# EAGLE design Nucleo_DCO_Output (EAGLE 9.0.1)
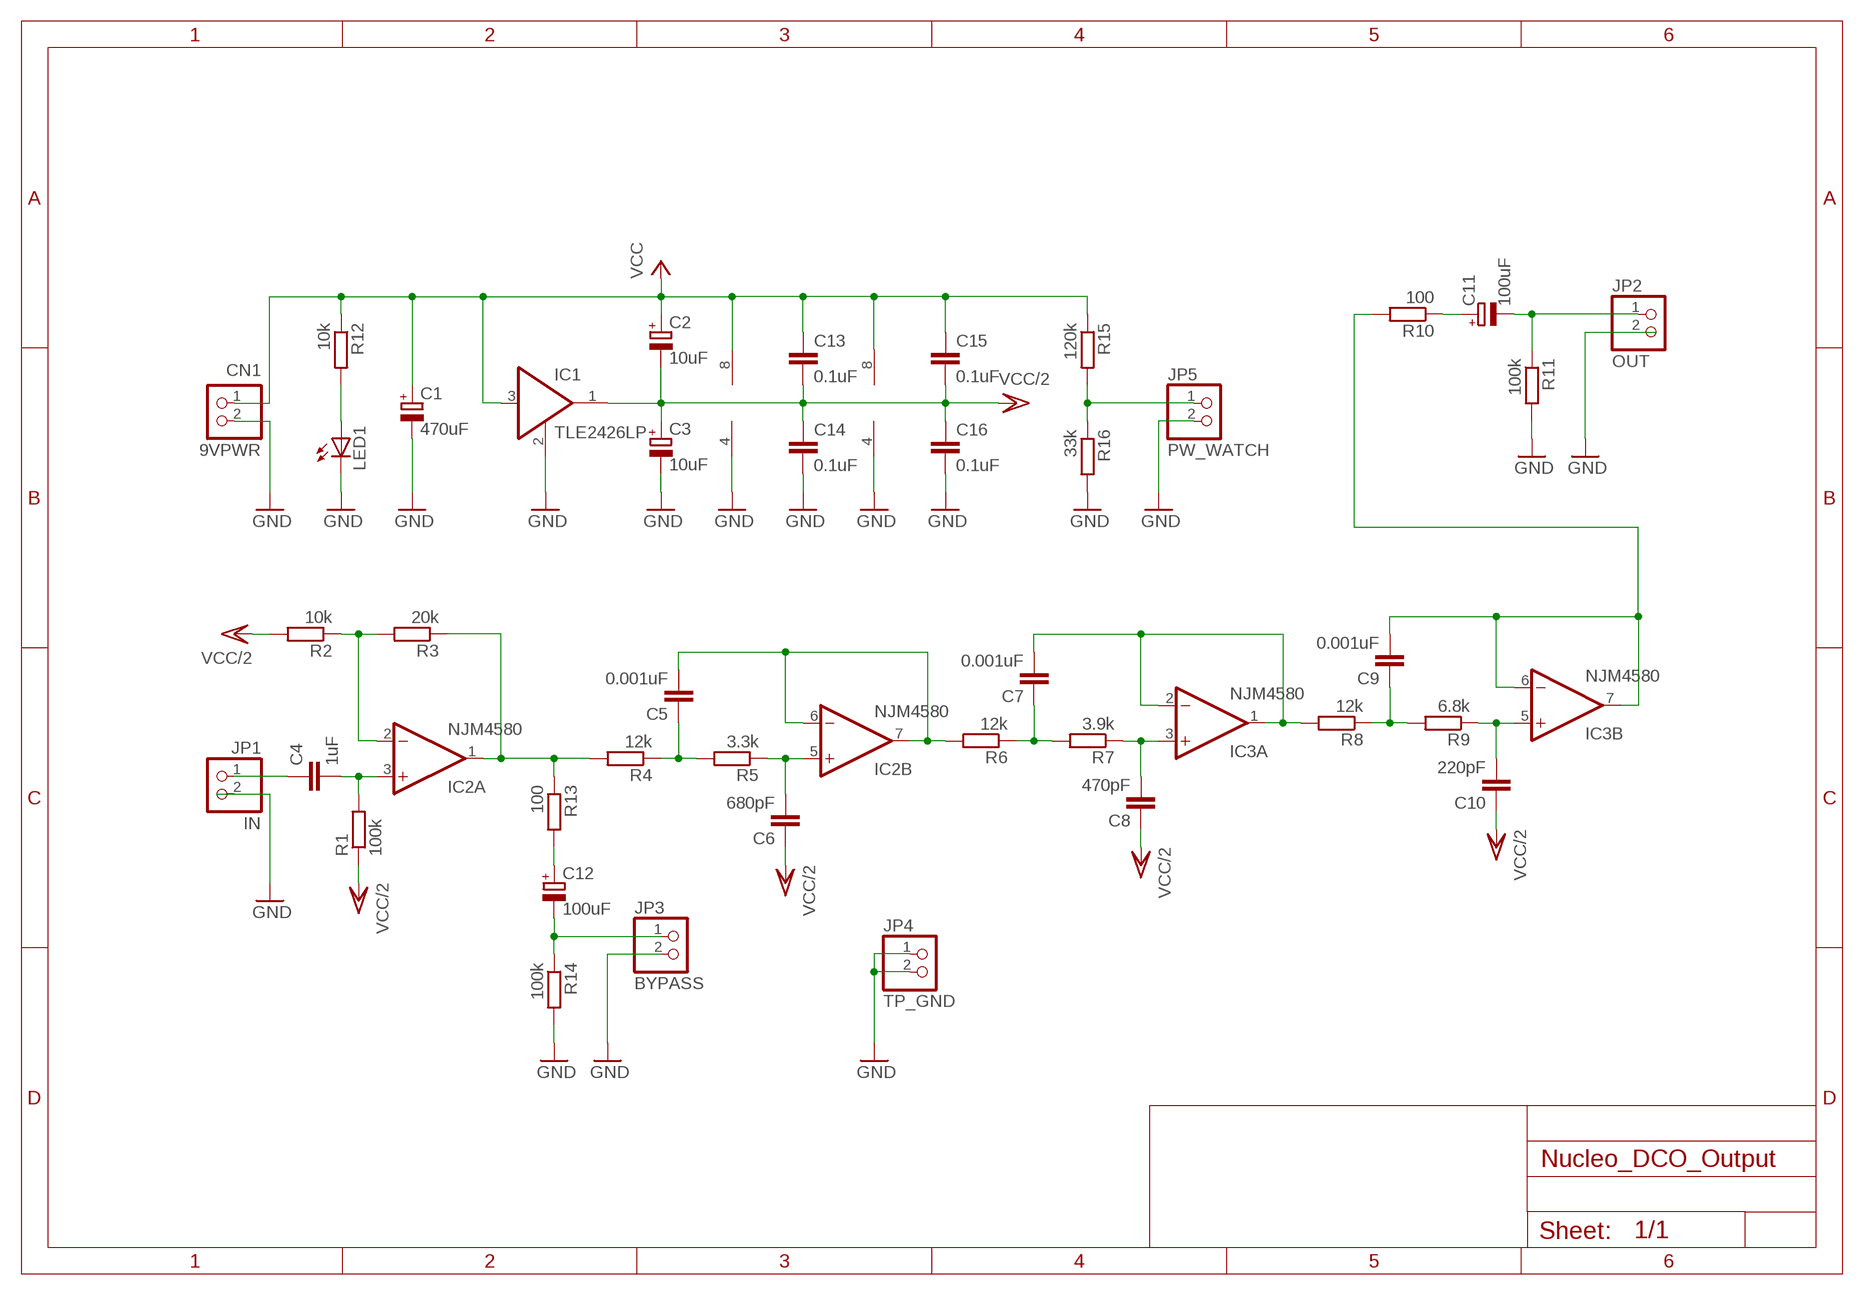
[diagram p0: schematic, sheet 1]

## Parts
C1  470uF  CPOL-EUSANYO_F13  [SANYO-OSCON_F13]
C2  10uF  CPOL-EUE2.5-6  [E2,5-6]
C3  10uF  CPOL-EUE2.5-6  [E2,5-6]
C4  1uF  C-EU050-035X075  [C050-035X075]
C5  0.001uF  C-EU050-035X075  [C050-035X075]
C6  680pF  C-EU050-035X075  [C050-035X075]
C7  0.001uF  C-EU050-035X075  [C050-035X075]
C8  470pF  C-EU050-035X075  [C050-035X075]
C9  0.001uF  C-EU050-035X075  [C050-035X075]
C10  220pF  C-EU050-035X075  [C050-035X075]
C11  100uF  CPOL-EUE5-8.5  [E5-8,5]
C12  100uF  CPOL-EUE5-8.5  [E5-8,5]
C13  0.1uF  C-EU025-024X044  [C025-024X044]
C14  0.1uF  C-EU050-024X044  [C050-024X044]
C15  0.1uF  C-EU025-024X044  [C025-024X044]
C16  0.1uF  C-EU025-024X044  [C025-024X044]
CN1  9VPWR  B2B-XH-A  [B2B-XH-A]
IC1  TLE2426LP  [TO226AA]
IC2  NJM4580  LM4558N  [DIL08]
IC3  NJM4580  LM4558N  [DIL08]
JP1  IN  PINHD-1X2  [1X02]
JP2  OUT  PINHD-1X2  [1X02]
JP3  BYPASS  PINHD-1X2  [1X02]
JP4  TP_GND  PINHD-1X2  [1X02]
JP5  PW_WATCH  PINHD-1X2  [1X02]
LED1  LED3MM  [LED3MM]
R1  100k  R-EU_0207/7  [0207/7]
R2  10k  R-EU_0207/7  [0207/7]
R3  20k  R-EU_0207/7  [0207/7]
R4  12k  R-EU_0207/7  [0207/7]
R5  3.3k  R-EU_0207/7  [0207/7]
R6  12k  R-EU_0207/7  [0207/7]
R7  3.9k  R-EU_0207/7  [0207/7]
R8  12k  R-EU_0207/7  [0207/7]
R9  6.8k  R-EU_0207/7  [0207/7]
R10  100  R-EU_0207/7  [0207/7]
R11  100k  R-EU_0207/7  [0207/7]
R12  10k  R-EU_0207/7  [0207/7]
R13  100  R-EU_0207/7  [0207/7]
R14  100k  R-EU_0207/7  [0207/7]
R15  120k  R-EU_0207/7  [0207/7]
R16  33k  R-EU_0207/7  [0207/7]

## Nets
GND: C1.- C3.- C14.2 C16.2 CN1.2 IC1.2 IC2.4(P:V-) IC3.4(P:V-) JP1.2 JP2.2 JP3.2 JP4.1 JP4.2 JP5.2 LED1.K(C) R11.2 R14.2 R16.2
N$1: IC2.1(A:OUT) R3.1 R4.2 R13.1
N$2: IC2.2(A:-IN) R2.1 R3.2
N$3: C6.2 IC2.5(B:+IN) R5.1
N$4: C4.1 JP1.1
N$5: C4.2 IC2.3(A:+IN) R1.2
N$6: C5.1 R4.1 R5.2
N$7: C11.+ R10.1
N$8: C11.- JP2.1 R11.1
N$9: C5.2 IC2.6(B:-IN) IC2.7(B:OUT) R6.2
N$10: C8.2 IC3.3(A:+IN) R7.1
N$11: C7.1 R6.1 R7.2
N$12: LED1.A R12.2
N$13: C7.2 IC3.1(A:OUT) IC3.2(A:-IN) R8.2
N$14: C10.2 IC3.5(B:+IN) R9.1
N$15: C9.1 R8.1 R9.2
N$16: C9.2 IC3.6(B:-IN) IC3.7(B:OUT) R10.2
N$18: C12.+ R13.2
N$19: C12.- JP3.1 R14.1
N$20: JP5.1 R15.2 R16.1
VCC: C1.+ C2.+ C13.1 C15.1 CN1.1 IC1.3(I) IC2.8(P:V+) IC3.8(P:V+) R12.1 R15.1
VCC/2: C2.- C3.+ C6.1 C8.1 C10.1 C13.2 C14.1 C15.2 C16.1 IC1.1(O) R1.1 R2.2

## Library data of the parts
C1-C3 C11 C12 = rcl:CPOL-EU: POLARIZED CAPACITOR, European symbol; SPICEPREFIX: C
C4-C10 C13-C16 = rcl:C-EU: CAPACITOR, European symbol; SPICEPREFIX: C
CN1 = jst-xh:B2B-XH-A: Wire-to-Board 2.5mm pitch top mount connector Source: http://www.jst-mfg.com/product/pdf/jpn/XH.pdf http://www.jst-mfg.com/product/detail.php?series=277
IC1 = mylib2:TLE2426LP: TLE2426 Rail Spliter TO-92
IC2 IC3 = linear:*4558: OP AMP
JP1-JP5 = pinhead:PINHD-1X2: PIN HEADER
LED1 = led:LED: LED OSRAM: - CHIPLED LG R971, LG N971, LY N971, LG Q971, LY Q971, LO R971, LY R971 LH N974, LH R974 LS Q976, LO Q976, LY Q976 LO Q996 - Hyper CHIPLED LW Q18S LB Q993, LB Q99A, LB R99A - SideLED LS A670, LO A670, LY A670, LG A670, LP A670 LB A673, LV A673, LT A673, LW A673 LH A674 LY A675 LS A676, LA A676, LO A676, LY A676, LW A676 LS A679, LY A679, LG A679 - Hyper Micro SIDELED® LS Y876, LA Y876, LO Y876, LY Y876 LT Y87S - SmartLED LW L88C, LW L88S LB L89C, LB L89S, LG L890 LS L89K, LO L89K, LY L89K LS L896, LA L896, LO L896, LY L896 - TOPLED LS T670, LO T670, LY T670, LG T670, LP T670 LSG T670, LSP T670, LSY T670, LOP T670, LYG T670 LG T671, LOG T671, LSG T671 LB T673, LV T673, LT T673, LW T673 LH T674 LS T676, LA T676, LO T676, LY T676, LB T676, LH T676, LSB T676, LW T676 LB T67C, LV T67C, LT T67C, LS T67K, LO T67K, LY T67K, LW E67C LS E67B, LA E67B, LO E67B, LY E67B, LB E67C, LV E67C, LT E67C LW T67C LS T679, LY T679, LG T679 LS T770, LO T770, LY T770, LG T770, LP T770 LB T773, LV T773, LT T773, LW T773 LH T774 LS E675, LA E675, LY E675, LS T675 LS T776, LA T776, LO T776, LY T776, LB T776 LHGB T686 LT T68C, LB T68C - Hyper Mini TOPLED® LB M676 - Mini TOPLED Santana® LG M470 LS M47K, LO M47K, LY M47K Source: http://www.osram.convergy.de LUXEON: - LUMILED® LXK2-PW12-R00, LXK2-PW12-S00, LXK2-PW14-U00, LXK2-PW14-V00 LXK2-PM12-R00, LXK2-PM12-S00, LXK2-PM14-U00 LXK2-PE12-Q00, LXK2-PE12-R00, LXK2-PE12-S00, LXK2-PE14-T00, LXK2-PE14-U00 LXK2-PB12-K00, LXK2-PB12-L00, LXK2-PB12-M00, LXK2-PB14-N00, LXK2-PB14-P00, LXK2-PB14-Q00 LXK2-PR12-L00, LXK2-PR12-M00, LXK2-PR14-Q00, LXK2-PR14-R00 LXK2-PD12-Q00, LXK2-PD12-R00, LXK2-PD12-S00 LXK2-PH12-R00, LXK2-PH12-S00 LXK2-PL12-P00, LXK2-PL12-Q00, LXK2-PL12-R00 Source: www.luxeon.com KINGBRIGHT: KA-3528ASYC Source: www.kingbright.com
R1-R16 = rcl:R-EU_: RESISTOR, European symbol; SPICEPREFIX: R

## Board
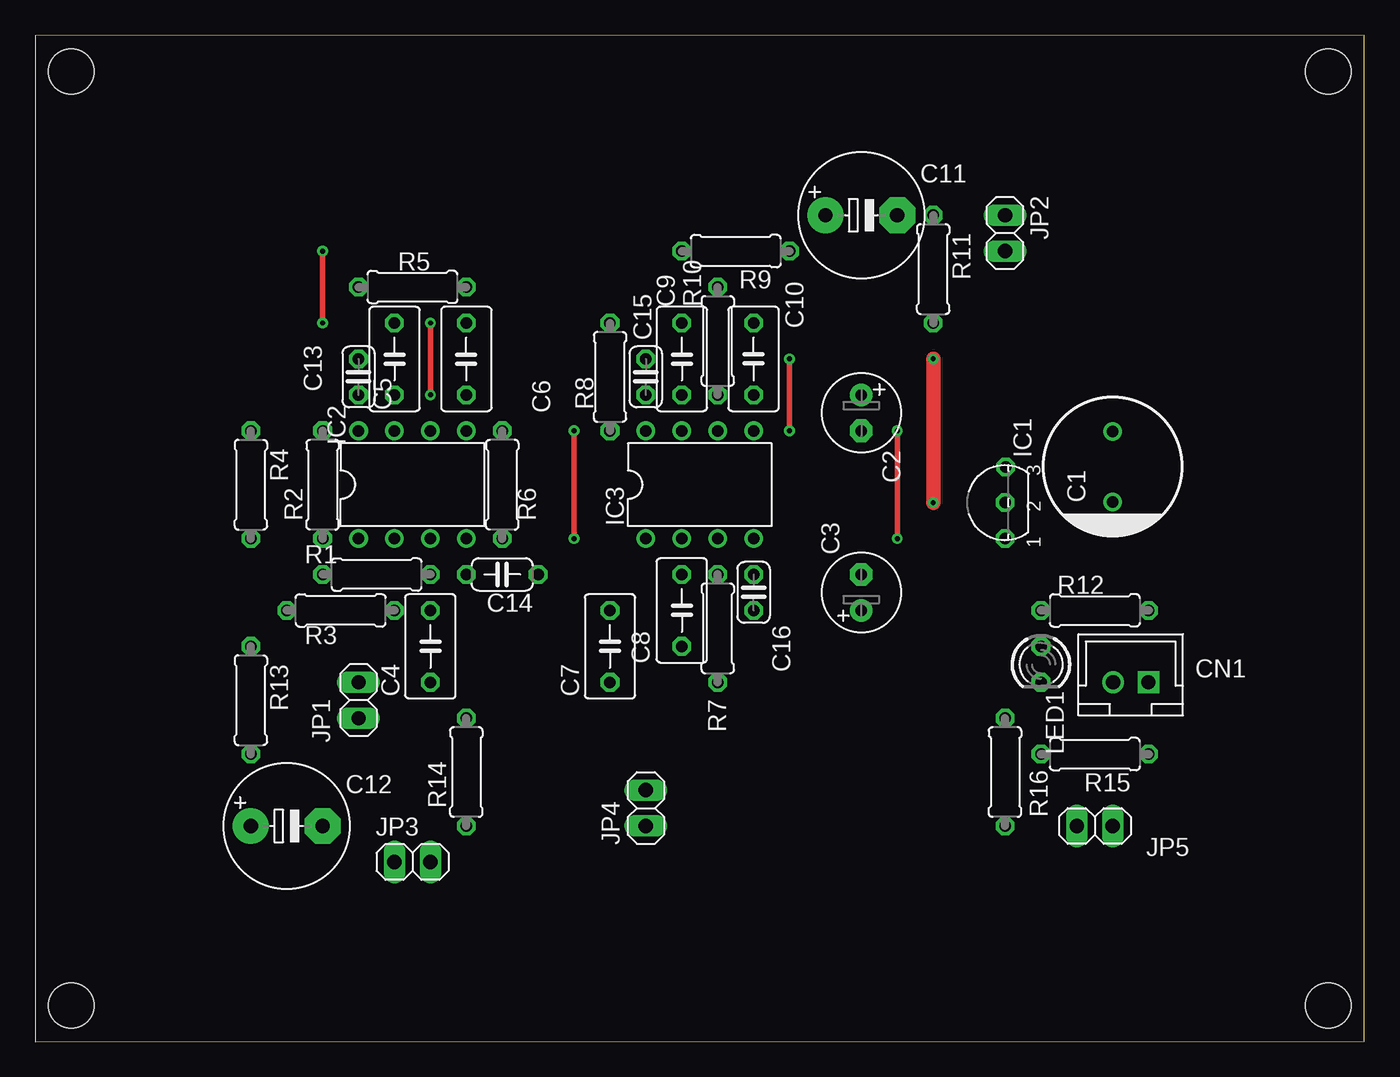
[diagram p1: board, top side]
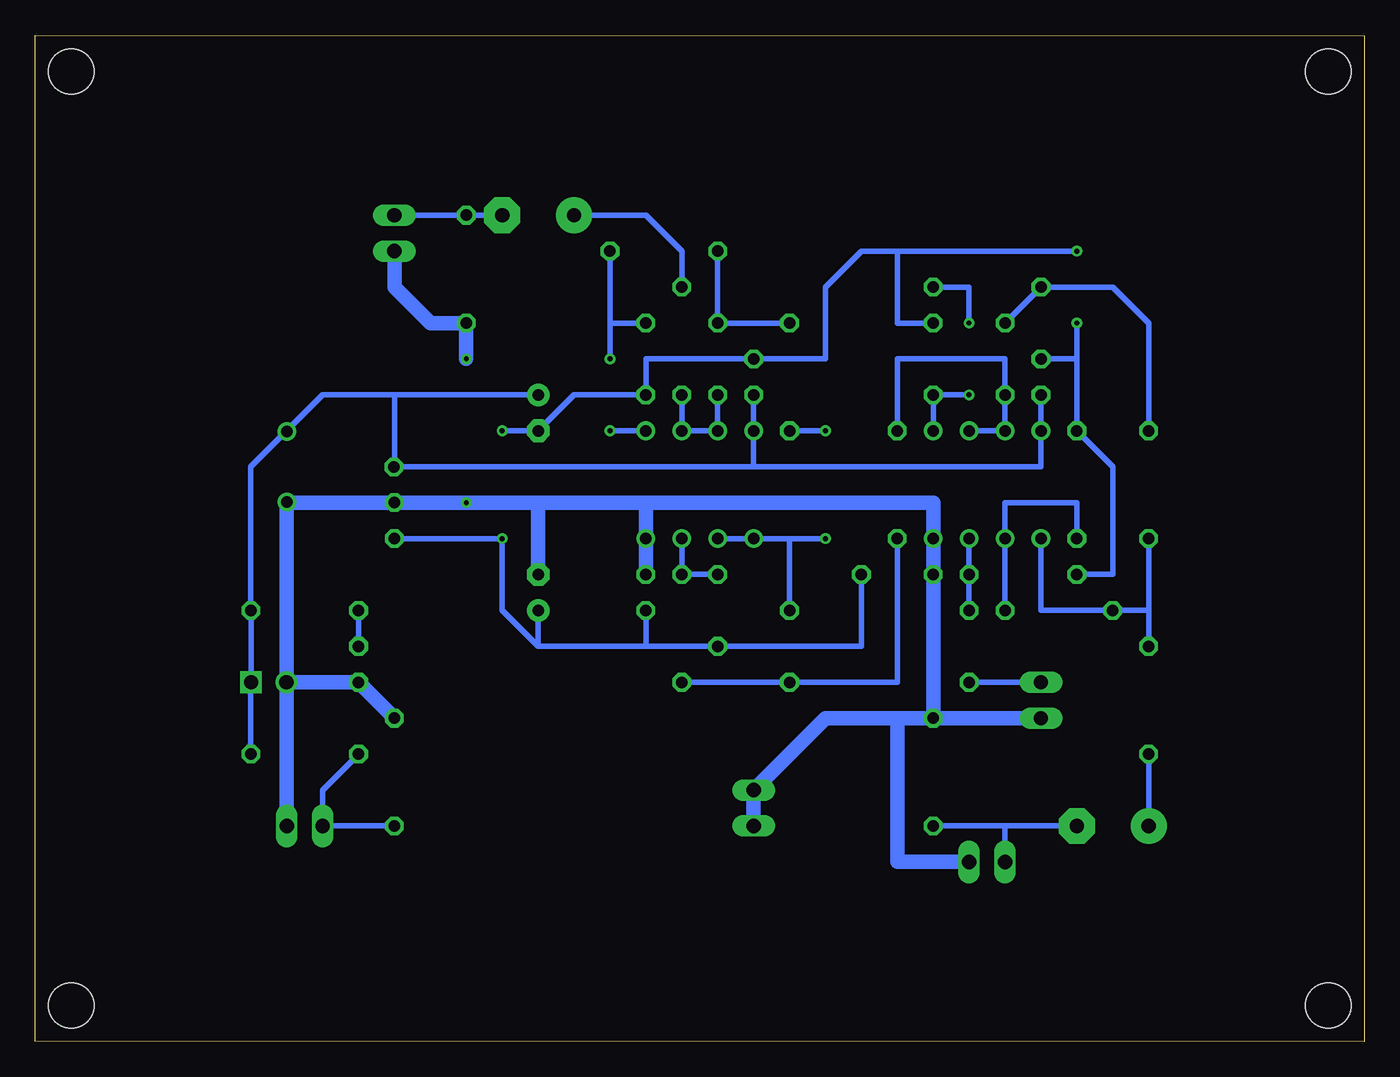
[diagram p2: board, bottom side, seen from below]

Size 93.98 x 71.14 mm. Coordinates in mm from the lower left corner, seen from the top.
Outline: 0,0 93.98,0.03 93.98,71.14 0,71.11 0,0
Copper layers (1*16): Top 0.035mm / dielectric 1.5mm / Bottom 0.035mm
Design rules "default": minimum track width 6mil, minimum drill 0.35mm, track to track 6mil, track to pad 6mil, pad to pad 6mil, via to via 6mil, smd to smd 6mil, copper to edge 40mil, drill to drill 6mil, minimum pad ring 10mil, minimum via ring 8mil, stop-mask expansion 4mil, vias tented up to drill 0mil, thermal gap 10mil
Holes 3.2 mm at 2.54,68.58 2.54,2.54 91.44,2.54 91.44,68.58

### Footprints (pad centres in the part's own frame; a part is rotated, then mirrored left to right if it is on the bottom)
SANYO-OSCON_F13 = drill 0.8 pad 1.27: + 2.5,0; - -2.5,0
E2,5-6 = drill 0.813 pad 1.6: + -1.27,0 | drill 0.813 pad 1.6 octagon: - 1.27,0
C050-035X075 = drill 0.813 octagon: 1 -2.54,0; 2 2.54,0
E5-8,5 = drill 1.016 pad 2.54: + -2.54,0 | drill 1.016 pad 2.54 octagon: - 2.54,0
C025-024X044 = drill 0.813 octagon: 1 -1.27,0; 2 1.27,0
C050-024X044 = drill 0.813 octagon: 1 -2.54,0; 2 2.54,0
B2B-XH-A = drill 1.016 square: 1 -1.25,0 | drill 1.016: 2 1.25,0
TO226AA = drill 0.813 octagon: 1 -2.544,0; 2 0.001,0; 3 2.524,-0.04
DIL08 = drill 0.813 pad 1.27: 1 -3.81,-3.81; 2 -1.27,-3.81; 3 1.27,-3.81; 4 3.81,-3.81; 5 3.81,3.81; 6 1.27,3.81; 7 -1.27,3.81; 8 -3.81,3.81
1X02 = drill 1.016 long: 1 -1.27,0; 2 1.27,0
LED3MM = drill 0.813 octagon: A -1.27,0; K 1.27,0
0207/7 = drill 0.813 octagon: 1 -3.81,0; 2 3.81,0

### Placement (x,y rotation side)
C1  76.2,40.64 90 top
C2  58.42,44.45 270 top
C3  58.42,31.75 90 top
C4  27.94,27.94 90 top
C5  25.4,48.26 270 top
C6  30.48,48.26 270 top
C7  40.64,27.94 90 top
C8  45.72,30.48 90 top
C9  45.72,48.26 270 top
C10  50.8,48.26 90 top
C11  58.42,58.42 0 top
C12  17.78,15.24 0 top
C13  22.86,46.99 90 top
C14  33.02,33.02 180 top
C15  43.18,46.99 90 top
C16  50.8,31.75 90 top
CN1  77.47,25.4 180 top
IC1  68.58,38.1 90 top
IC2  26.67,39.37 0 top
IC3  46.99,39.37 0 top
JP1  22.86,24.13 270 top
JP2  68.58,57.15 270 top
JP3  26.67,12.7 0 top
JP4  43.18,16.51 90 top
JP5  74.93,15.24 0 top
LED1  71.12,26.67 270 top
R1  24.13,33.02 0 top
R2  20.32,39.37 90 top
R3  21.59,30.48 0 top
R4  15.24,39.37 270 top
R5  26.67,53.34 180 top
R6  33.02,39.37 90 top
R7  48.26,29.21 270 top
R8  40.64,46.99 270 top
R9  49.53,55.88 180 top
R10  48.26,49.53 270 top
R11  63.5,54.61 270 top
R12  74.93,30.48 180 top
R13  15.24,24.13 270 top
R14  30.48,19.05 90 top
R15  74.93,20.32 180 top
R16  68.58,19.05 90 top

### Tracks (layer width: path | path; a pad name or v marks a point on that pad's centre or on a via)
GND  (via drill 0.35)
  Top 1.016: v63.5,48.26 v63.5,38.1
  Bottom 0.406: 66.04,38.1
  Bottom 1.016: 50.8,38.1 30.48,38.1 IC2.4 C14.2 R14.2 | 50.8,38.1 IC3.4 C16.2 | 66.04,38.1 v63.5,38.1 58.42,38.1 | 58.42,38.1 50.8,38.1 | C3.- 58.42,38.1 | IC1.2 66.04,38.1 | C1.- 76.16,38.1 | 76.16,38.1 IC1.2 | IC1.2 | 76.2,25.42 CN1.2 LED1.K R16.2 | 76.2,25.42 76.2,38.1 76.16,38.1 | R14.2 33.02,22.86 | 33.02,22.86 38.1,22.86 JP4.2 JP4.1 | JP1.2 R14.2 | JP3.2 33.02,12.7 33.02,22.86 | v63.5,48.26 R11.2 66.04,50.8 68.58,53.34 JP2.2 | JP5.2 76.2,25.42
N$1
  Bottom 0.406: IC2.1 22.86,30.48 R3.1 15.24,30.48 | R4.2 15.24,30.48 | 15.24,30.48 R13.1
N$2
  Bottom 0.406: R3.2 IC2.2 25.4,38.1 20.32,38.1 R2.1
N$3  (via drill 0.35)
  Top 0.406: v27.94,45.72 v27.94,50.8
  Bottom 0.406: IC2.5 C6.2 v27.94,45.72 | R5.1 27.94,53.34 v27.94,50.8
N$4
  Bottom 0.406: JP1.1 C4.1
N$5
  Bottom 0.406: IC2.3 R1.2 C4.2
N$6
  Bottom 0.406: C5.1 R5.2 17.78,53.34 15.24,50.8 R4.1
N$7
  Bottom 0.406: R10.1 48.26,55.88 50.8,58.42 C11.+
N$8
  Bottom 0.406: C11.- R11.1 JP2.1
N$9
  Bottom 0.406: IC2.6 IC2.7 C5.2 25.4,48.26 33.02,48.26 R6.2
N$10
  Bottom 0.406: IC3.3 R7.1 C8.2
N$11
  Bottom 0.406: R6.1 33.02,25.4 C7.1 R7.2
N$12
  Bottom 0.406: R12.2 LED1.A
N$13  (via drill 0.35)
  Top 0.406: v38.1,35.56 v38.1,43.18
  Bottom 0.406: IC3.2 IC3.1 40.64,35.56 | 40.64,35.56 v38.1,35.56 | v38.1,43.18 R8.2 | C7.2 40.64,35.56
N$14  (via drill 0.35)
  Top 0.406: v53.34,43.18 v53.34,48.26
  Bottom 0.406: IC3.5 v53.34,43.18 | v53.34,48.26 53.34,50.8 | 53.34,50.8 R9.1 | C10.2 53.34,50.8
N$15
  Bottom 0.406: R8.1 C9.1 R9.2
N$16
  Bottom 0.406: C9.2 IC3.7 IC3.6 R10.2
N$18
  Bottom 0.406: R13.2 C12.+
N$19
  Bottom 0.406: C12.- 25.4,15.24 | 25.4,15.24 R14.1 | JP3.1 25.4,15.24
N$20
  Bottom 0.406: R15.2 73.66,17.78 JP5.1 R16.1
VCC
  Bottom 0.406: 43.18,40.64 22.86,40.64 IC2.8 C13.1 | 43.18,40.64 IC3.8 C15.1 | C2.+ 68.58,45.72 | 68.58,45.72 73.66,45.72 76.2,43.18 C1.+ 76.24,43.14 78.74,40.64 R12.1 78.72,30.46 CN1.1 78.74,25.4 R15.1 | 43.18,40.64 43.2,40.62 IC1.3 68.58,40.66 68.58,45.72
VCC/2  (via drill 0.35)
  Top 0.406: v20.32,50.8 v20.32,55.88 | v60.96,35.56 v60.96,43.18
  Bottom 0.406: 20.32,48.26 R2.2 17.78,40.64 17.78,33.02 R1.1 | 20.32,48.26 v20.32,50.8 | v20.32,55.88 33.02,55.88 | 33.02,55.88 33.02,50.8 C6.1 | IC1.1 v60.96,35.56 60.96,30.48 58.42,27.94 | v60.96,43.18 C2.- 55.88,45.72 C10.1 50.8,48.26 C15.2 38.1,48.26 38.1,53.34 35.56,55.88 33.02,55.88 | 50.8,27.94 C8.1 35.56,27.94 C14.1 | 50.8,27.94 58.42,27.94 | C3.+ 58.42,27.94 | C13.2 20.32,48.26 | C16.1 50.8,27.94

### Text on the board
Document: Nucleo DCO Output Board | http://dad8893.blogspot.com/